# EAGLE design USB_Serial_Convertor_Kevin_Dang (EAGLE 9.6.2)
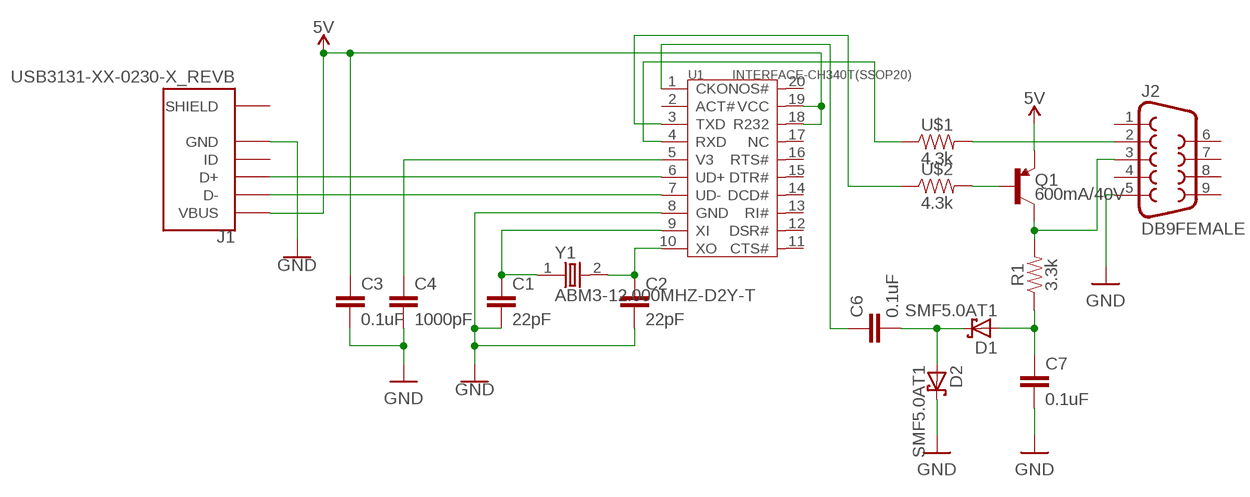
[diagram p0: schematic, sheet 1]

## Parts
C1  22pF  22PF-0402T-16V-10%  [0402-TIGHT]
C2  22pF  22PF-0402T-16V-10%  [0402-TIGHT]
C3  0.1uF  0.1UF-0402T-10V-10%-X7R  [0402-TIGHT]
C4  1000pF  0.1UF-0402T-10V-10%-X7R  [0402-TIGHT]
C6  0.1uF  0.1UF-0402T-10V-10%-X7R  [0402-TIGHT]
C7  0.1uF  0.1UF-0402T-10V-10%-X7R  [0402-TIGHT]
D1  SMF5.0AT1  [SOD123FL]
D2  SMF5.0AT1  [SOD123FL]
J1  USB3131-XX-0230-X_REVB  [GCT_USB3131-XX-0230-X_REVB]
J2  DB9FEMALE  [DB9]
Q1  600mA/40V  TRANS_PNP-MMBT4403  [SOT23-3]
R1  3.3k  3.3KOHM-0603-1/10W-1%  [0603]
U1  INTERFACE-CH340T(SSOP20)  [SSOP20-0.65-7.6X5.2MM]
U$1  4.3k  4.3KOHM-0402  [0402_MURATA]
U$2  4.3k  4.3KOHM-0402  [0402_MURATA]
Y1  ABM3-12.000MHZ-D2Y-T  [XTAL500X320X130N]

## Nets
5V: C3.1 J1.1(VBUS) Q1.2(E) U1.18(R232) U1.19(VCC)
GND: C1.2 C2.2 C3.2 C4.2 C7.2 D2.C J1.5(GND) J2.5 U1.8(GND)
N$1: J1.3(D+) U1.6(UD+)
N$2: J1.2(D-) U1.7(UD-)
N$3: C1.1 U1.9(XI) Y1.1
N$4: C2.1 U1.10(XO) Y1.2
N$5: U1.4(RXD) U$1.P$1
N$6: J2.2 U$1.P$2
N$7: U1.3(TXD) U$2.P$1
N$8: Q1.1(B) U$2.P$2
N$9: J2.3 Q1.3(C) R1.2
N$10: C7.1 D1.A R1.1
N$11: C6.2 D1.C D2.A
N$12: C6.1 U1.1(CKO)
V3: C4.1 U1.5(V3)
Unconnected: J1.4(ID) J1.6(SHIELD) J1.7(SHIELD) J2.1 J2.4 J2.6 J2.7 J2.8 J2.9 U1.2(ACT#) U1.11(CTS#) U1.12(DSR#) U1.13(RI#) U1.14(DCD#) U1.15(DTR#) U1.16(RTS#) U1.17(NC) U1.20(NOS#)

## Library data of the parts
C1 C2 = SparkFun-Capacitors:22PF: 22pF ceramic capacitors A capacitor is a passive two-terminal electrical component used to store electrical energy temporarily in an electric field.; PROD_ID: CAP-14674
C3 C6 C7 = SparkFun-Capacitors:0.1UF: 0.1µF ceramic capacitors A capacitor is a passive two-terminal electrical component used to store electrical energy temporarily in an electric field.; PROD_ID: CAP-15083
C4 = SparkFun-Capacitors:0.1UF: 0.1µF ceramic capacitors A capacitor is a passive two-terminal electrical component used to store electrical energy temporarily in an electric field.; PROD_ID: CAP-15083; VALUE: 0.1uF
D1 D2 = _mod_diode:SMF5.0AT1: 200 W Transient Voltage Suppressor Source: Data sheet <http://www.onsemi.com/pub_link/Collateral/SMF5.0AT1-D.PDF>
J1 = USB3131-XX-0230-X_REVB:USB3131-XX-0230-X_REVB: Micro USB Receptacle, Type B, Through-Hole, Vertical, With 2.30mm (Standart) Shell Stakes; AVAILABILITY: Unavailable; DESCRIPTION: USB - micro B USB 2.0 Receptacle Connector 5 Position Through Hole; DIGIKEY-PURCHASE-URL: https://snapeda.com/shop?store=DigiKey&id=697014; MF: Global Connector Technology; MP: USB3131-30-0230-A; PACKAGE: None; PRICE: None
J2 = DB9:DB9: DB9 Connector Standard DB9 (D-Sub 9) serial connector. Can be used for CAN bus as well as RS485 and RS232. Footprint production proven. Spark Fun Electronics SKU : PRT-00429; AVAILABILITY: Unavailable; DESCRIPTION: SURGE SUPPRESSOR RS-232 DB9M/F; MF: Tripp Lite; MP: DB9; PACKAGE: None; PRICE: None
Q1 = SparkFun-DiscreteSemi:TRANS_PNP: PNP transistor Current controlled devices typically used to amplify current or used as a switch. SparkFun Products: SparkFun Serial Enabled 16x2 LCD - Red on Black <https://www.sparkfun.com/products/9068> SparkFun Logomatic <https://www.sparkfun.com/products/12772>; PROD_ID: TRANS-09245
R1 = SparkFun-Resistors:3.3KOHM: 3.3kΩ resistor A resistor is a passive two-terminal electrical component that implements electrical resistance as a circuit element. Resistors act to reduce current flow, and, at the same time, act to lower voltage levels within circuits. - Wikipedia; PROD_ID: RES-07851
U1 = INTERFACE-CH340T_SSOP20_:INTERFACE-CH340T(SSOP20): 310070026; AVAILABILITY: Unavailable; DESCRIPTION: CH340 USB 2.0 to UART Interface Evaluation Board; MF: Olimex LTD; MP: CH340T; PACKAGE: None; PRICE: None
U$1 U$2 = SparkFun-Resistors:4.3KOHM; PROD_ID: RES-14355
Y1 = ABM3-12.000MHZ-D2Y-T:ABM3-12.000MHZ-D2Y-T: Crystals 12MHz 18pF 30ppm -40C +85C; AVAILABILITY: Unavailable; DESCRIPTION: 12MHz ±20ppm Crystal 18pF 60 Ohms 2-SMD, No Lead; MF: Abracon; MP: ABM3-12.000MHZ-D2Y-T; PACKAGE: SMD-2 Abracon; PRICE: None

## Board
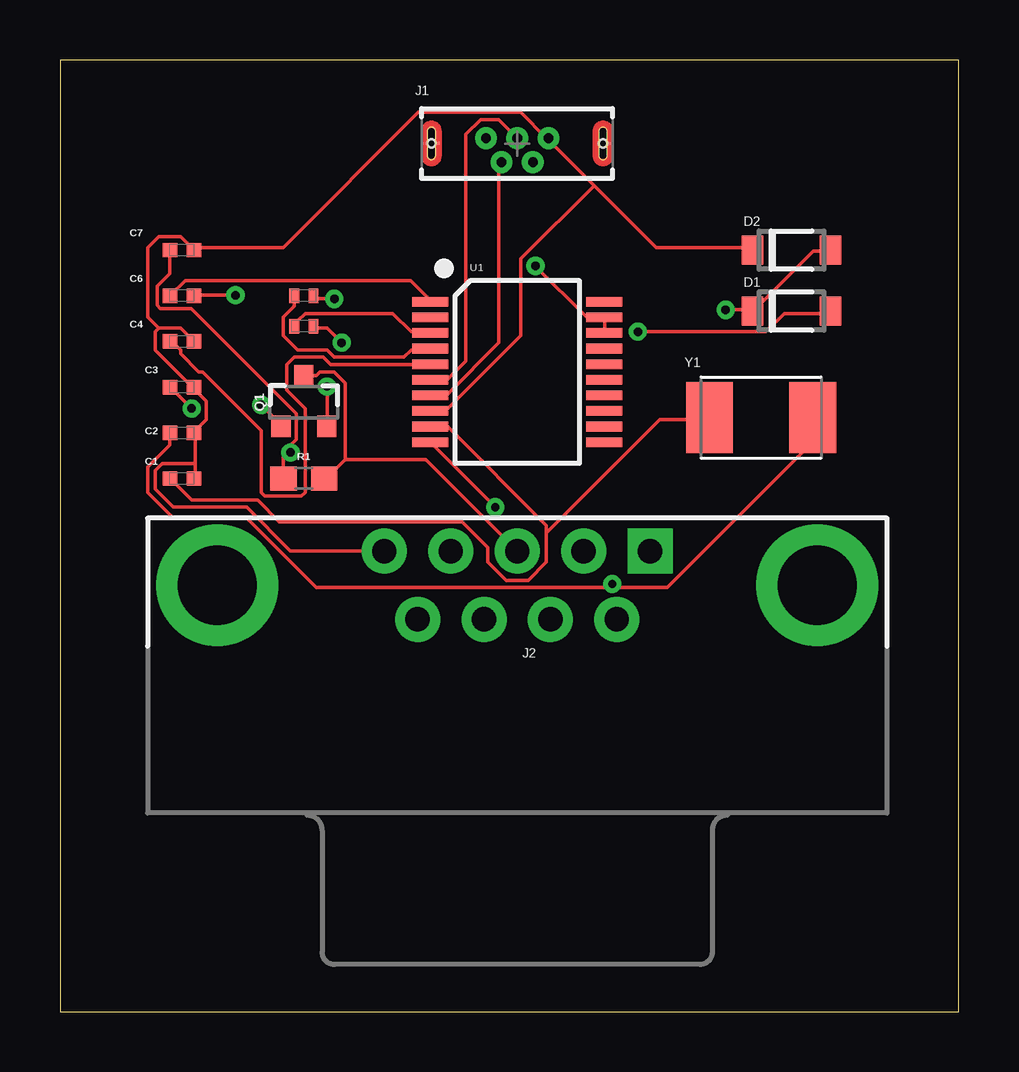
[diagram p1: board, top side]
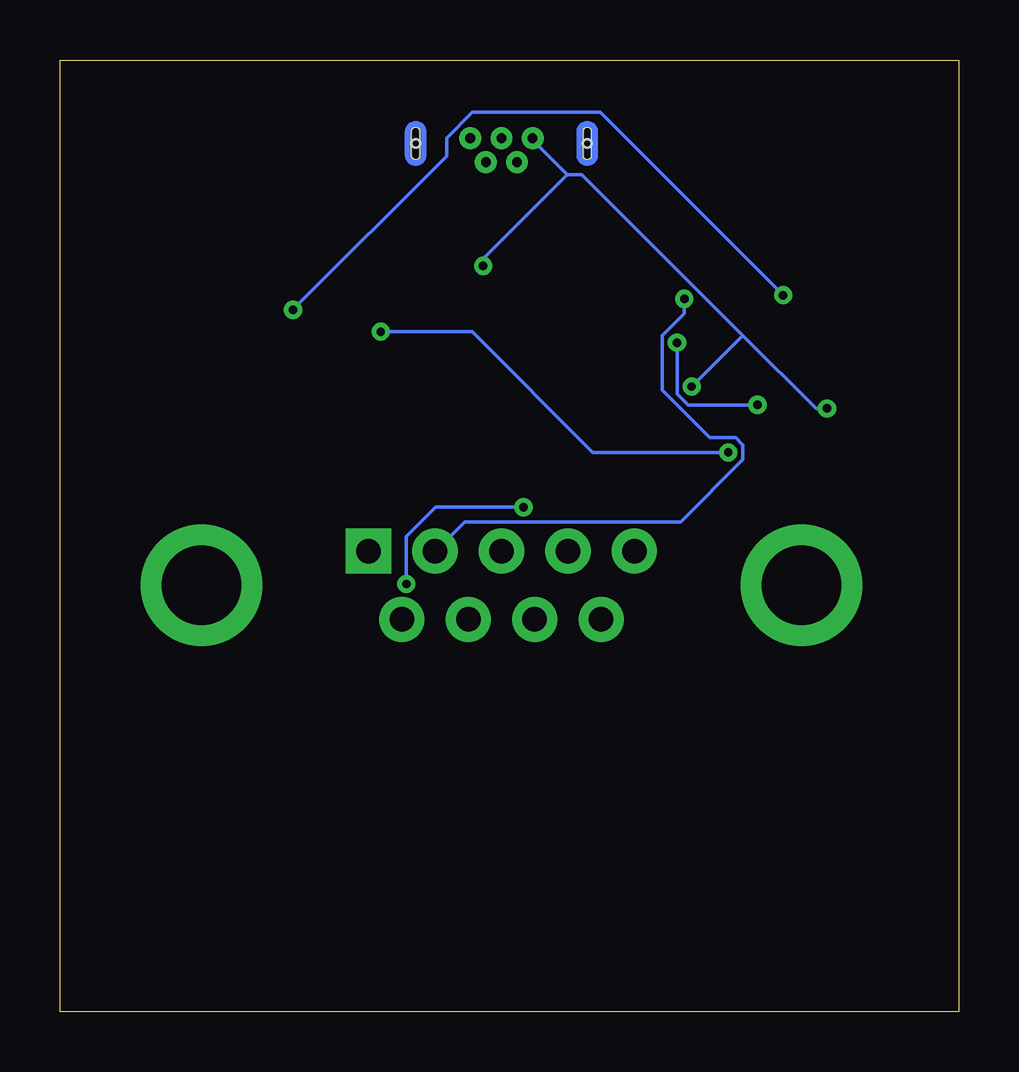
[diagram p2: board, bottom side, seen from below]

Size 37.45 x 39.67 mm. Coordinates in mm from the lower left corner, seen from the top.
Outline: 0,0 37.45,0 37.45,39.67 0,39.67 0,0
Copper layers (1*16): Top 0.035mm / dielectric 1.5mm / Bottom 0.035mm
Design rules "default": minimum track width 6mil, minimum drill 0.35mm, track to track 6mil, track to pad 6mil, pad to pad 6mil, via to via 6mil, smd to smd 6mil, copper to edge 40mil, drill to drill 6mil, minimum pad ring 10mil, minimum via ring 8mil, stop-mask expansion 4mil, vias tented up to drill 0mil, thermal gap 10mil

### Footprints (pad centres in the part's own frame; a part is rotated, then mirrored left to right if it is on the bottom)
0402-TIGHT = smd 0.6 x 0.6: 1 -0.5,0; 2 0.5,0
SOD123FL = smd 0.91 x 1.22: A 1.625,0; C -1.625,0
GCT_USB3131-XX-0230-X_REVB = drill 0.4 pad 0.9: 1 -1.3,0.22; 2 -0.65,-0.78; 3 0,0.22; 4 0.65,-0.78; 5 1.3,0.22 | smd 0.1 x 0.1: 6 -3.275,0; 7 3.875,0 | hole 0.35: -3.575,0; 3.575,0
DB9 = drill 1.016 pad 1.88 square: 1 -5.54,-1.42 | drill 1.016 pad 1.88: 2 -2.77,-1.42; 3 0,-1.42; 4 2.77,-1.42; 5 5.54,-1.42; 6 -4.15,1.42; 7 -1.38,1.42; 8 1.38,1.42; 9 4.15,1.42 | drill 3.302 pad 5.08: G1 -12.5,0; G2 12.5,0
SOT23-3 = smd 0.8 x 0.9: 1 -0.95,-1; 2 0.95,-1; 3 0,1.1
0603 = smd 1.1 x 1: 1 -0.85,0; 2 0.85,0
SSOP20-0.65-7.6X5.2MM = smd 0.4 x 1.5: 1 -2.925,-3.625; 2 -2.275,-3.625; 3 -1.625,-3.625; 4 -0.975,-3.625; 5 -0.325,-3.625; 6 0.325,-3.625; 7 0.975,-3.625; 8 1.625,-3.625; 9 2.275,-3.625; 10 2.925,-3.625; 11 2.925,3.625; 12 2.275,3.625; 13 1.625,3.625; 14 0.975,3.625; 15 0.325,3.625; 16 -0.325,3.625; 17 -0.975,3.625; 18 -1.625,3.625; 19 -2.275,3.625; 20 -2.925,3.625
0402_MURATA = smd 0.4 x 0.6: P$1 -0.4,0; P$2 0.4,0
XTAL500X320X130N = smd 1.95 x 2.95: 1 -2.15,0; 2 2.15,0

### Placement (x,y rotation side)
C1  5.08,22.23 0 top
C2  5.08,24.13 0 top
C3  5.08,26.04 0 top
C4  5.08,27.94 0 top
C6  5.08,29.84 0 top
C7  5.08,31.75 0 top
D1  30.48,29.21 0 top
D2  30.48,31.75 0 top
J1  19.05,36.2 0 top
J2  19.05,17.78 180 top
Q1  10.16,25.4 0 top
R1  10.16,22.23 0 top
U1  19.05,26.67 270 top
U$1  10.16,29.84 0 top
U$2  10.16,28.57 0 top
Y1  29.21,24.77 0 top

### Tracks (layer width: path | path; a pad name or v marks a point on that pad's centre or on a via)
5V  (via drill 0.35)
  Top 0.152: U1.18 22.71,28.35 22.71,28.8 U1.19 22.55,28.96 21.95,28.96 v19.81,31.09 | v5.49,25.15 4.72,25.91 C3.1 | v11.12,26.06 11.12,24.54 Q1.2
  Bottom 0.152: v5.49,25.15 5.94,25.15 8.99,28.19 | 8.99,28.19 15.7,34.9 16.31,34.9 | 16.31,34.9 17.68,36.27 J1.1 | 8.99,28.19 v11.12,26.06 | v19.81,31.09 19.81,31.39 16.31,34.9
GND
  Top 0.152: 5.64,22.86 5.64,24.08 C2.2 5.64,24.23 6.1,24.69 6.1,25.45 5.64,25.91 C3.2 5.49,26.06 3.96,27.58 3.96,28.35 4.12,28.5 | 5.64,22.86 5.64,22.25 C1.2 | 4.12,28.5 5.03,28.5 5.49,28.04 C4.2 | 4.12,28.5 3.66,28.96 3.66,31.85 4.12,32.31 5.03,32.31 5.49,31.85 C7.2 5.64,31.85 9.3,31.85 14.94,37.49 19.2,37.49 20.27,36.42 J1.5 20.42,36.27 22.25,34.44 | 5.64,22.86 4.27,22.86 3.96,22.55 3.96,21.79 4.72,21.03 7.77,21.03 9.6,19.2 13.41,19.2 J2.5 | 22.25,34.44 24.84,31.85 28.8,31.85 D2.C | 22.25,34.44 19.2,31.39 19.2,28.19 16.15,25.15 15.54,25.15 U1.8
N$1
  Top 0.152: U1.6 15.54,26.36 16.15,26.36 16.92,27.13 16.92,36.58 17.53,37.19 18.29,37.19 19.05,36.42 J1.3
N$2
  Top 0.152: U1.7 15.54,25.76 16.15,25.76 18.29,27.89 18.29,35.36 J1.2
N$3
  Top 0.152: 20.27,19.96 20.27,20.27 16.15,24.38 15.54,24.38 U1.9 | 20.27,19.96 20.27,18.75 19.51,17.98 18.59,17.98 17.83,18.75 17.83,19.36 16.76,20.42 9.14,20.42 8.23,21.34 5.49,21.34 4.72,22.1 C1.1 | 20.27,19.96 24.99,24.69 26.98,24.69 Y1.1
N$4  (via drill 0.35)
  Top 0.152: 23.01,17.68 25.3,17.68 31.24,23.62 31.24,24.69 Y1.2 | 23.01,17.68 10.67,17.68 7.77,20.57 4.72,20.57 3.66,21.64 3.66,22.71 4.57,23.62 4.57,24.08 C2.1 | v18.14,21.03 15.54,23.62 U1.10 | 23.01,17.68 v23.01,17.83
  Bottom 0.152: v18.14,21.03 21.79,21.03 23.01,19.81 v23.01,17.83
N$5
  Top 0.152: U$1.P$1 9.75,29.72 9.75,29.41 9.3,28.96 9.3,28.19 9.91,27.58 11.12,27.58 11.43,27.28 14.33,27.28 14.63,27.58 15.39,27.58 U1.4
N$6  (via drill 0.35)
  Top 0.152: v11.43,29.72 10.67,29.72 U$1.P$2
  Bottom 0.152: v11.43,29.72 11.43,29.11 12.34,28.19 12.34,25.91 10.36,23.93 9.3,23.93 8.99,23.62 8.99,23.01 11.58,20.42 20.57,20.42 21.79,19.2 J2.2
N$7
  Top 0.152: U$2.P$1 9.91,28.65 9.91,28.8 10.21,29.11 13.87,29.11 14.63,28.35 15.39,28.35 U1.3
N$8  (via drill 0.35)
  Top 0.152: v11.73,27.89 11.12,28.5 10.67,28.5 U$2.P$2 | v8.38,25.3 9.14,24.54 Q1.1
  Bottom 0.152: v11.73,27.89 11.73,25.76 11.28,25.3 v8.38,25.3
N$9
  Top 0.152: 11.89,23.01 11.89,26.21 11.43,26.67 10.82,26.67 10.67,26.52 10.21,26.52 Q1.3 | 11.89,23.01 11.12,22.25 R1.2 | 11.89,23.01 15.24,23.01 J2.3
N$10  (via drill 0.35)
  Top 0.152: R1.1 9.31,23.33 9.45,23.47 | 9.45,23.47 9.84,23.86 9.84,24.95 5.47,29.32 4.18,29.32 4.05,29.45 4.05,30.24 4.58,30.77 C7.1 | v24.08,28.35 29.41,28.35 30.18,29.11 32,29.11 D1.A | 9.45,23.47 v9.6,23.32 | 9.45,23.47
  Bottom 0.152: v24.08,28.35 20.27,28.35 15.24,23.32 v9.6,23.32
N$11  (via drill 0.35)
  Top 0.152: v7.32,29.87 5.64,29.87 C6.2 | v27.74,29.26 28.8,29.26 D1.C 28.96,29.26 31.39,31.7 32,31.7 D2.A
  Bottom 0.152: v7.32,29.87 14.94,37.49 20.27,37.49 21.34,36.42 21.34,35.66 v27.74,29.26
N$12
  Top 0.152: C6.1 5.21,30.48 14.61,30.48 15.43,29.66 U1.1
V3
  Top 0.152: C4.1 4.72,27.89 5.03,27.58 5.03,27.43 5.79,26.67 5.94,26.67 8.38,24.23 8.38,21.64 8.53,21.49 10.06,21.49 10.21,21.64 10.21,25.15 9.45,25.91 9.45,26.98 9.75,27.28 10.97,27.28 11.28,26.98 15.39,26.98 U1.5